# EAGLE design a1200-led (EAGLE 9.3.2)
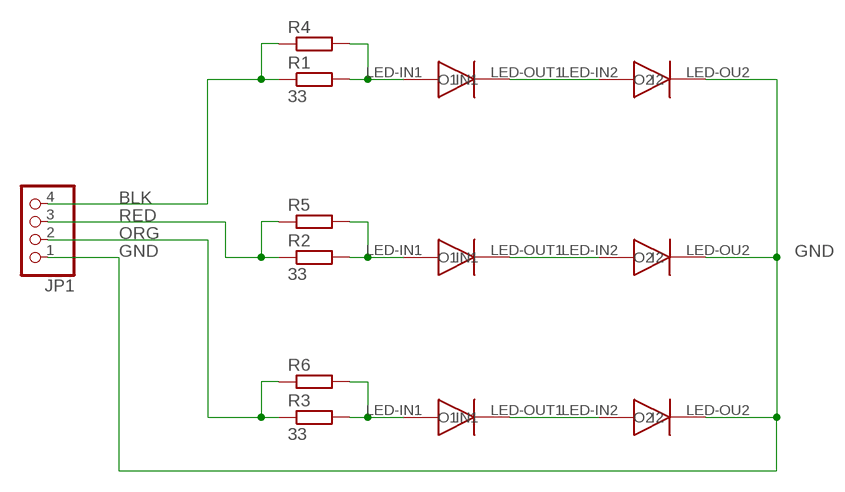
[diagram p0: schematic, sheet 1]

## Parts
JP1  PINHD-1X4  [1X04]
LED1  A1200-LED  [A1200-LED]
LED2  A1200-LED  [A1200-LED]
LED3  A1200-LED  [A1200-LED]
R1  33  R-EU_0207/10  [0207/10]
R2  33  R-EU_0207/10  [0207/10]
R3  33  R-EU_0207/10  [0207/10]
R4  R-EU_R1206  [R1206]
R5  R-EU_R1206  [R1206]
R6  R-EU_R1206  [R1206]

## Nets
BLK: JP1.4 R1.1 R4.1
GND: JP1.1 LED1.LED-OU2(O2) LED2.LED-OU2(O2) LED3.LED-OU2(O2)
N$1: LED1.LED-IN1(IN1) R1.2 R4.2
N$2: LED1.LED-IN2(I2) LED1.LED-OUT1(O1)
N$4: LED2.LED-IN1(IN1) R2.2 R5.2
N$5: LED2.LED-IN2(I2) LED2.LED-OUT1(O1)
N$7: LED3.LED-IN1(IN1) R3.2 R6.2
N$8: LED3.LED-IN2(I2) LED3.LED-OUT1(O1)
ORG: JP1.2 R3.1 R6.1
RED: JP1.3 R2.1 R5.1

## Library data of the parts
JP1 = pinhead:PINHD-1X4: PIN HEADER
LED1-LED3 = codm:A1200-LED: Retrofit A1200 LED
R1-R6 = rcl:R-EU_: RESISTOR, European symbol; SPICEPREFIX: R

## Board
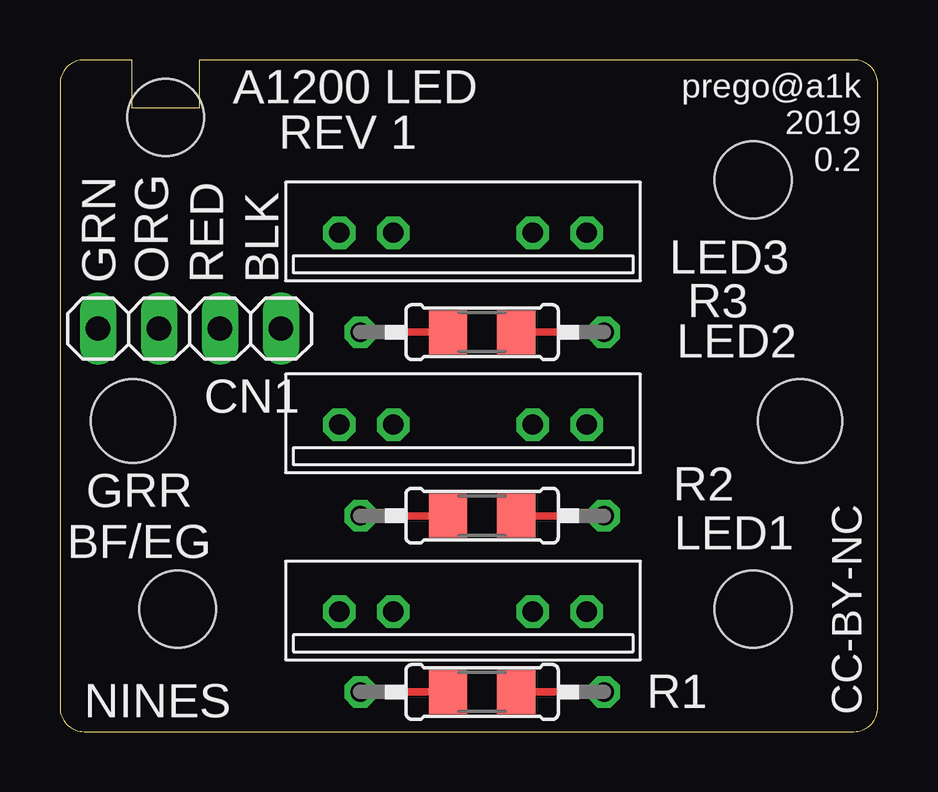
[diagram p1: board, top side]
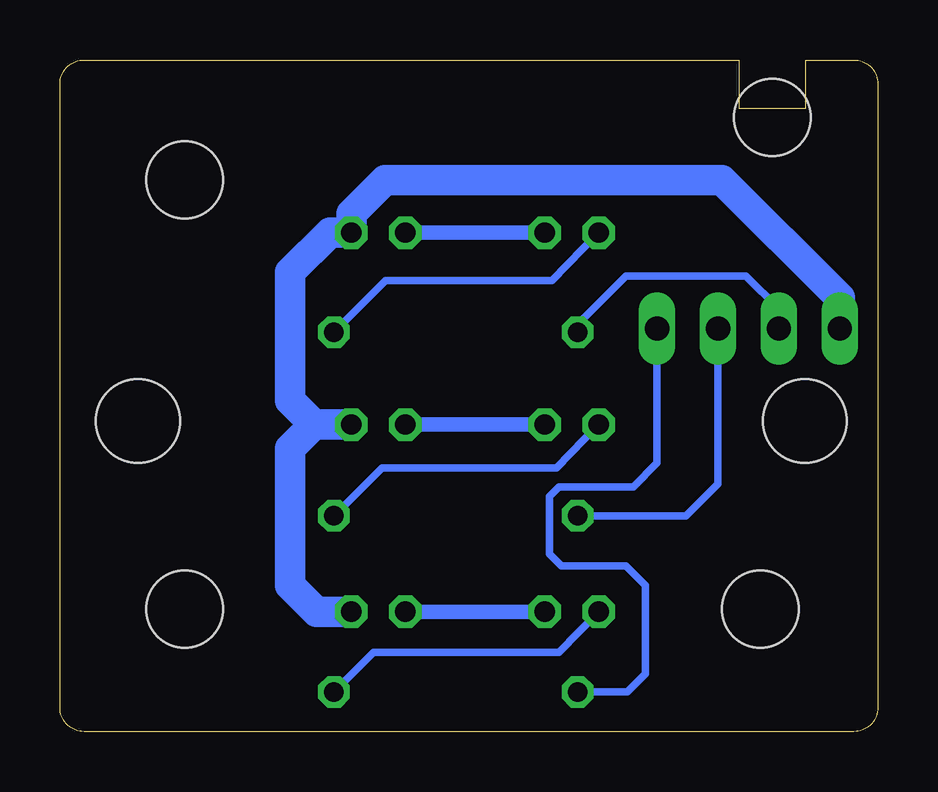
[diagram p2: board, bottom side, seen from below]

Size 34.1 x 28 mm. Coordinates in mm from the lower left corner, seen from the top.
Outline: 1,0 33.1,0 arc90 34.1,1 34.1,27 arc90 33.1,28 5.8,28 5.8,26 3,26 3,28 1,28 arc90 0,27 0,1 arc90 1,0
Copper layers (1*16): Top 0.035mm / dielectric 1.5mm / Bottom 0.035mm
Design rules "aisler_go_2layer": minimum track width 0.1mm, minimum drill 0.2mm, track to track 0.1mm, track to pad 0.1mm, pad to pad 0.1mm, via to via 0.1mm, smd to smd 0.1mm, copper to edge 0.2mm, drill to drill 0.21mm, minimum pad ring 0.25mm, minimum via ring 0.05mm, stop-mask expansion 0.01mm, vias tented up to drill 0mil, thermal gap 10mil
Holes 3.2 mm at 4.9,5.1 28.9,5.1 28.9,23 4.4,25.6
Holes 3.5 mm at 3.05,12.95 30.85,12.95

### Footprints (pad centres in the part's own frame; a part is rotated, then mirrored left to right if it is on the bottom)
1X04 = drill 1.016 long: 1 -3.81,0; 2 -1.27,0; 3 1.27,0; 4 3.81,0
A1200-LED = drill 0.85 octagon: LED-IN1 2.25,2; LED-IN2 10.3,2; LED-OU2 12.55,2; LED-OUT1 4.5,2
0207/10 = drill 0.813 octagon: 1 -5.08,0; 2 5.08,0
R1206 = smd 1.6 x 1.803: 1 -1.422,0; 2 1.422,0

### Placement (x,y rotation side)
JP1  5.4,16.8 0 top
LED1  9.4,3 0 top
LED2  9.4,10.8 0 top
LED3  9.4,18.8 0 top
R1  17.6,1.65 0 top
R2  17.6,9 0 top
R3  17.6,16.65 0 top
R4  17.6,1.65 0 top
R5  17.6,9 0 top
R6  17.6,16.65 0 top

### Tracks (layer width: path | path; a pad name or v marks a point on that pad's centre or on a via)
BLK
  Top 0.305: R1.1 R4.1
  Bottom 0.305: JP1.4 9.21,11.19 10.2,10.2 13.3,10.2 13.7,9.8 13.7,7.4 13.2,6.9 10.5,6.9 9.7,6.1 9.7,2.4 10.45,1.65 R1.1
GND
  Bottom 1.27: JP1.1 1.59,18.09 6.5,23 20.55,23 21.95,21.6 LED3.LED-OU2 22.85,20.8 24.5,19.15 24.5,13.8 23.5,12.8 | LED2.LED-OU2 23.5,12.8 | 23.5,12.8 24.5,11.8 24.5,6.1 23.4,5 LED1.LED-OU2
N$1
  Top 0.305: R4.2 R1.2
  Bottom 0.305: R1.2 21.03,3.3 13.3,3.3 LED1.LED-IN1
N$2
  Bottom 0.61: LED1.LED-OUT1 LED1.LED-IN2
N$4
  Top 0.305: R5.2 R2.2
  Bottom 0.305: R2.2 20.68,11 13.4,11 LED2.LED-IN1
N$5
  Bottom 0.61: LED2.LED-OUT1 LED2.LED-IN2
N$7
  Top 0.305: R6.2 R3.2
  Bottom 0.305: R3.2 20.53,18.8 13.6,18.8 LED3.LED-IN1
N$8
  Bottom 0.61: LED3.LED-OUT1 LED3.LED-IN2
ORG
  Top 0.305: R3.1 R6.1
  Bottom 0.305: JP1.2 4.13,17.63 5.5,19 10.5,19 12.5,17 12.5,16.67 R3.1
RED
  Top 0.305: R2.1 R5.1
  Bottom 0.305: JP1.3 6.67,10.33 8,9 R2.1

### Text on the board
tNames: A1200 LED | REV 1 | prego@a1k / 2019 / 0.2 | LED3 | GRN | ORG | RED | BLK | LED2 | CN1 | GRR / BF/EG | LED1 | CC-BY-NC | NINES